# EAGLE board Sij (EAGLE 7.6.0)
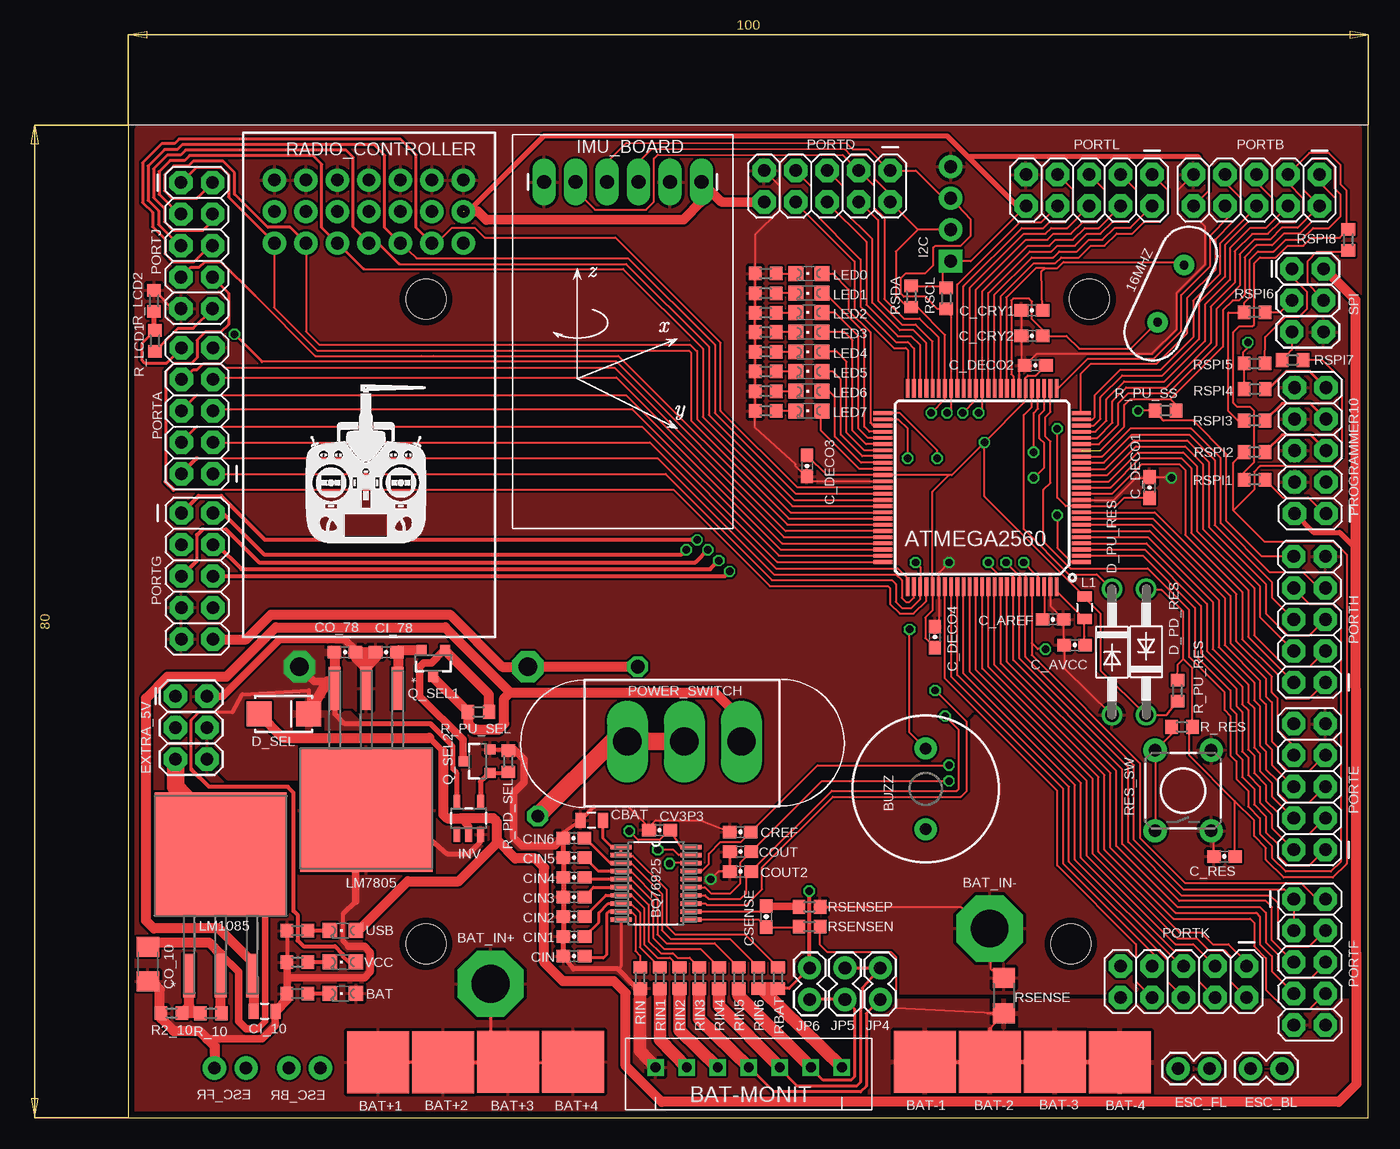
[diagram p2: board, top side]
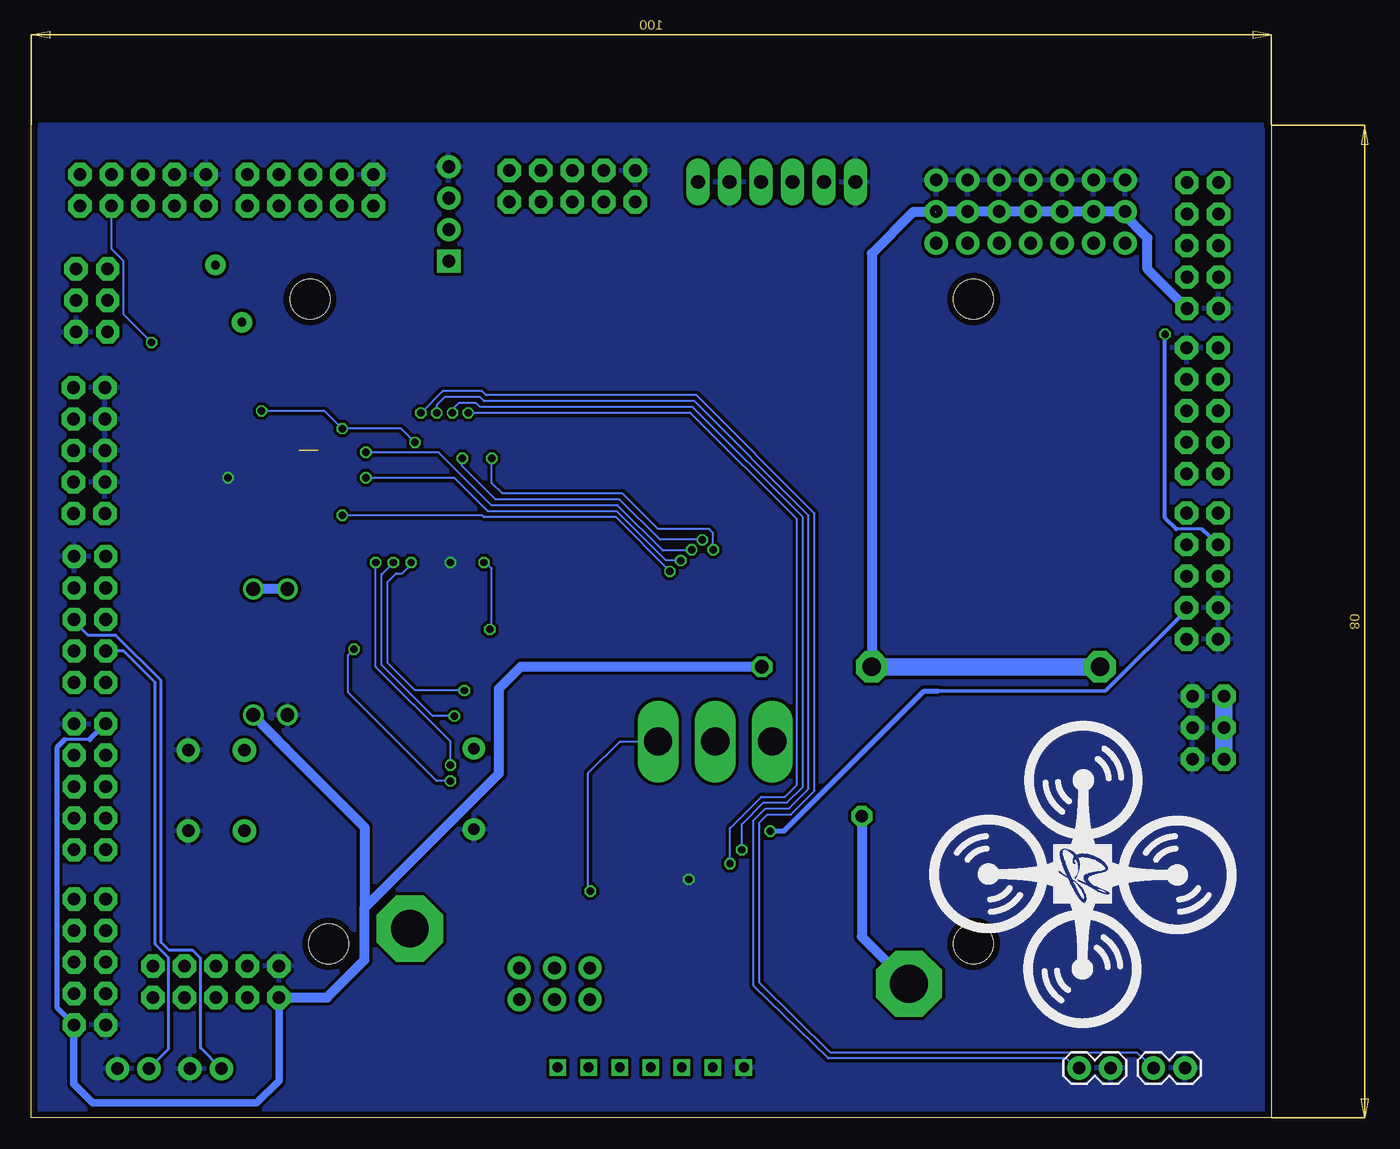
[diagram p3: board, bottom side, seen from below]

Size 100 x 80 mm. Coordinates in mm from the lower left corner, seen from the top.
Outline: 100,80 100,0 0,0 0,80
Copper layers (1*16): Top 0.035mm / dielectric 1.5mm / Bottom 0.035mm
Design rules "ShenZhen2U_2layer_EagleRules": minimum track width 7mil, minimum drill 12mil, track to track 7mil, track to pad 7mil, pad to pad 7mil, via to via 7mil, smd to smd 0mil, copper to edge 20mil, drill to drill 10mil, minimum pad ring 10mil, minimum via ring 6mil, stop-mask expansion 2mil, vias tented up to drill 25mil, thermal gap 10mil
Holes 3.2 mm at 24,14 76,14 77.51,66 24,66

## Footprints (pad centres in the part's own frame; a part is rotated, then mirrored left to right if it is on the bottom)
HC49US = drill 0.7 pad 1.651: 1 -2.54,0; 2 2.54,0
TQFP100 = smd 1.5 x 0.3: 1 -8,6; 2 -8,5.5; 3 -8,5; 4 -8,4.5; 5 -8,4; 6 -8,3.5; 7 -8,3; 8 -8,2.5; 9 -8,2; 10 -8,1.5; 11 -8,1; 12 -8,0.5; 13 -8,0; 14 -8,-0.5; 15 -8,-1; 16 -8,-1.5; 17 -8,-2; 18 -8,-2.5; 19 -8,-3; 20 -8,-3.5; 21 -8,-4; 22 -8,-4.5; 23 -8,-5; 24 -8,-5.5; 25 -8,-6; 51 8,-6; 52 8,-5.5; 53 8,-5; 54 8,-4.5; 55 8,-4; 56 8,-3.5; 57 8,-3; 58 8,-2.5; 59 8,-2; 60 8,-1.5; 61 8,-1; 62 8,-0.5; 63 8,0; 64 8,0.5; 65 8,1; 66 8,1.5; 67 8,2; 68 8,2.5; 69 8,3; 70 8,3.5; 71 8,4; 72 8,4.5; 73 8,5; 74 8,5.5; 75 8,6 | smd 0.3 x 1.5: 26 -6,-8; 27 -5.5,-8; 28 -5,-8; 29 -4.5,-8; 30 -4,-8; 31 -3.5,-8; 32 -3,-8; 33 -2.5,-8; 34 -2,-8; 35 -1.5,-8; 36 -1,-8; 37 -0.5,-8; 38 0,-8; 39 0.5,-8; 40 1,-8; 41 1.5,-8; 42 2,-8; 43 2.5,-8; 44 3,-8; 45 3.5,-8; 46 4,-8; 47 4.5,-8; 48 5,-8; 49 5.5,-8; 50 6,-8; 76 6,8; 77 5.5,8; 78 5,8; 79 4.5,8; 80 4,8; 81 3.5,8; 82 3,8; 83 2.5,8; 84 2,8; 85 1.5,8; 86 1,8; 87 0.5,8; 88 0,8; 89 -0.5,8; 90 -1,8; 91 -1.5,8; 92 -2,8; 93 -2.5,8; 94 -3,8; 95 -3.5,8; 96 -4,8; 97 -4.5,8; 98 -5,8; 99 -5.5,8; 100 -6,8
CHIPLED_0805 = smd 1.2 x 1.2: A 0,-1.05; C 0,1.05
4.5MM_SQUARE = smd 5 x 5: IN 0,0
7_PIN_JST-XH = drill 0.8 square: P$1 2.45,3.4; P$2 4.95,3.4; P$3 7.45,3.4; P$4 9.95,3.4; P$5 12.45,3.4; P$6 14.95,3.4; P$7 17.45,3.4
AWG10_HOLE_PAD = drill 3.048 pad 5.334 octagon: BAT_CONNECTOR 0,0
PW20 = smd 1.676 x 0.356: 1 -2.819,2.925; 2 -2.819,2.275; 3 -2.819,1.625; 4 -2.819,0.975; 5 -2.819,0.325; 6 -2.819,-0.325; 7 -2.819,-0.975; 8 -2.819,-1.625; 9 -2.819,-2.275; 10 -2.819,-2.925; 11 2.819,-2.925; 12 2.819,-2.275; 13 2.819,-1.625; 14 2.819,-0.975; 15 2.819,-0.325; 16 2.819,0.325; 17 2.819,0.975; 18 2.819,1.625; 19 2.819,2.275; 20 2.819,2.925
BUZZER-12MM = drill 0.9 pad 1.778: + 3.25,0; - -3.25,0
0603-CAP = smd 1.1 x 1: 1 -0.85,0; 2 0.85,0
0805 = smd 0.8 x 1.2: 1 -0.9,0; 2 0.9,0
1206 = smd 1.6 x 1.8: 1 -1.4,0; 2 1.4,0
DO41-10 = drill 1.118: A 5.08,0; C -5.08,0
SMA-DIODE_ALT = smd 2 x 2: A -2,0; C 2,0
1X02 = drill 1.016 pad 1.88: 1 0,0; 2 2.54,0
2X3 = drill 1.016 pad 1.88 octagon: 1 0,0; 2 0,2.54; 3 2.54,0; 4 2.54,2.54; 5 5.08,0; 6 5.08,2.54
1X04_NO_SILK = drill 1.016 pad 1.88 square: 1 0,0 | drill 1.016 pad 1.88: 2 2.54,0; 3 5.08,0; 4 7.62,0
1X06_LONGPADS = drill 1.118 pad 1.88 long: 1 0,0; 2 2.54,0; 3 5.08,0; 4 7.62,0; 5 10.16,0; 6 12.7,0
SOT23-5 = smd 0.55 x 1.2: 1 -0.95,-1.3; 2 0,-1.3; 3 0.95,-1.3; 4 0.95,1.3; 5 -0.95,1.3
KTT3 = smd 0.965 x 3.505: 1 -2.54,-9.677; 2 0,-9.677; 3 2.54,-9.677 | smd 10.668 x 9.957: 4 0,0.152
AVR_ICSP = drill 1.016 pad 1.88 octagon: 1 -1.27,5.08; 2 1.27,5.08; 3 -1.27,2.54; 4 1.27,2.54; 5 -1.27,0; 6 1.27,0; 7 -1.27,-2.54; 8 1.27,-2.54; 9 -1.27,-5.08; 10 1.27,-5.08
SWITCH-SPDT_KIT = drill 2.286 pad 3.302 long: 1 0,4.597; 2 0,0; 3 0,-4.597
SOT23-3 = smd 0.8 x 0.9: 1 -0.95,-1; 2 0.95,-1; 3 0,1.1
R0603 = smd 1 x 1.1: 1 -0.85,0; 2 0.85,0
3X07 = drill 1.016 pad 1.88: 1 0,0; 2 2.54,0; 3 5.08,0; 4 7.62,0; 5 10.16,0; 6 12.7,0; 7 15.24,0; 8 0,-2.54; 9 2.54,-2.54; 10 5.08,-2.54; 11 7.62,-2.54; 12 10.16,-2.54; 13 12.7,-2.54; 14 15.24,-2.54; 15 0,-5.08; 16 2.54,-5.08; 17 5.08,-5.08; 18 7.62,-5.08; 19 10.16,-5.08; 20 12.7,-5.08; 21 15.24,-5.08
TACTILE-PTH = drill 1.016 pad 1.88: 1 -3.251,2.261; 2 3.251,2.261; 3 -3.251,-2.261; 4 3.251,-2.261
R1206 = smd 1.6 x 1.803: 1 -1.422,0; 2 1.422,0

## Placement (x,y rotation side)
16MHZ  16MHz  [HC49US]  84.06,66.44 245 top
ATMEGA2560  ATMEGA2560AU  [TQFP100]  68.85,50.8 180 top
BAT  [CHIPLED_0805]  17.3,10 90 top
BAT+1  BULLET_PAD  [4.5MM_SQUARE]  20.14,4.45 0 top
BAT+2  BULLET_PAD  [4.5MM_SQUARE]  25.38,4.45 0 top
BAT+3  BULLET_PAD  [4.5MM_SQUARE]  30.62,4.5 0 top
BAT+4  BULLET_PAD  [4.5MM_SQUARE]  35.85,4.5 0 top
BAT-1  BULLET_PAD  [4.5MM_SQUARE]  64.24,4.5 0 top
BAT-2  BULLET_PAD  [4.5MM_SQUARE]  69.47,4.5 0 top
BAT-3  BULLET_PAD  [4.5MM_SQUARE]  74.71,4.5 0 top
BAT-4  BULLET_PAD  [4.5MM_SQUARE]  79.95,4.45 0 top
BAT-MONIT  7_PIN_JST-XH  [7_PIN_JST-XH]  40.08,0.63 0 top
BAT_IN+  AWG_10_HOLE_PAD  [AWG10_HOLE_PAD]  29.21,10.79 180 top
BAT_IN-  AWG_10_HOLE_PAD  [AWG10_HOLE_PAD]  69.45,15.24 180 top
BQ76925  BQ76925_PW_20  [PW20]  42.55,18.89 0 top
BUZZ  BUZZERPTH  [BUZZER-12MM]  64.29,26.5 270 top
C_AREF  0.1u  [0603-CAP]  74.57,40.16 0 top
C_AVCC  0.1u  [0603-CAP]  76.31,38.1 180 top
C_CRY1  22pF  [0603-CAP]  72.87,65.09 0 top
C_CRY2  22pF  [0603-CAP]  72.87,63.02 0 top
C_DECO1  0.1uF  [0603-CAP]  82.35,50.8 90 top
C_DECO2  0.1uF  [0603-CAP]  73.14,60.64 180 top
C_DECO3  0.1uF  [0603-CAP]  54.72,52.55 270 top
C_DECO4  0.1uF  [0603-CAP]  65.04,38.74 90 top
C_RES  0.1uF  [0603-CAP]  88.39,21.05 180 top
CBAT  10uF  [0805]  37.37,23.97 180 top
CI_10  10uF  [0805]  11,8.58 0 top
CI_78  0.22uF  [0603-CAP]  20.8,37.51 180 top
CIN  1.0uF  [0603-CAP]  35.94,13.02 180 top
CIN1  1.0uF  [0603-CAP]  35.94,14.6 180 top
CIN2  1.0uF  [0603-CAP]  35.94,16.19 180 top
CIN3  1.0uF  [0603-CAP]  35.94,17.78 180 top
CIN4  1.0uF  [0603-CAP]  35.94,19.37 180 top
CIN5  1.0uF  [0603-CAP]  35.94,20.96 180 top
CIN6  1.0uF  [0603-CAP]  35.92,22.53 180 top
CO_10  10uF  [1206]  1.58,12.37 270 top
CO_78  0.1uF  [0603-CAP]  17.47,37.51 0 top
COUT  0.1u  [0603-CAP]  49.37,21.43 180 top
COUT2  1.0uF  [0603-CAP]  49.37,19.84 180 top
CREF  1.0uF  [0603-CAP]  49.35,23.03 180 top
CSENSE  0.1u  [0603-CAP]  51.43,16.19 90 top
CV3P3  4.7uF  [0603-CAP]  42.84,23.18 180 top
D_PD_RES  1N4004  [DO41-10]  79.32,37.53 270 top
D_PU_RES  1N4004  [DO41-10]  82.08,37.55 90 top
D_SEL  CDBA320L  [SMA-DIODE_ALT]  12.55,32.54 0 top
ESC_BL  640455 TE connectivity  [1X02]  90.5,3.94 0 top
ESC_BR  640455 TE connectivity  [1X02]  15.5,4 0 bottom
ESC_FL  640455 TE connectivity  [1X02]  84.66,3.94 0 top
ESC_FR  640455 TE connectivity  [1X02]  9.5,4 0 bottom
EXTRA_5V  FEMALE 2x3  [2X3]  3.81,33.97 270 top
I2C  [1X04_NO_SILK]  66.31,69.05 90 top
IMU_BOARD  M06_IMU  [1X06_LONGPADS]  33.52,75.44 0 top
INV  TC7SU04F  [SOT23-5]  27.45,24.13 0 top
JP4  [1X02]  60.64,9.52 90 top
JP5  [1X02]  57.79,12.06 270 top
JP6  [1X02]  54.93,9.52 90 top
L1  10uH  [0805]  77.11,41.12 270 top
LED0  [CHIPLED_0805]  54.89,68.06 90 top
LED1  [CHIPLED_0805]  54.89,66.47 90 top
LED2  [CHIPLED_0805]  54.89,64.92 90 top
LED3  [CHIPLED_0805]  54.89,63.33 90 top
LED4  [CHIPLED_0805]  54.89,61.74 90 top
LED5  [CHIPLED_0805]  54.89,60.16 90 top
LED6  [CHIPLED_0805]  54.89,58.57 90 top
LED7  [CHIPLED_0805]  54.89,56.98 90 top
LM1085  LM1085_KTT_3  [KTT3]  7.46,21.11 0 top
LM7805  LM7805  [KTT3]  19.19,24.92 180 top
PORTA  [AVR_ICSP]  5.56,57 180 top
PORTB  [AVR_ICSP]  90.96,74.77 270 top
PORTD  [AVR_ICSP]  56.35,75.09 270 top
PORTE  [AVR_ICSP]  95.25,26.67 180 top
PORTF  [AVR_ICSP]  95.25,12.54 0 top
PORTG  [AVR_ICSP]  5.56,43.66 0 top
PORTH  [AVR_ICSP]  95.25,40.16 180 top
PORTJ  [AVR_ICSP]  5.53,70.31 0 top
PORTK  [AVR_ICSP]  85.09,10.95 270 top
PORTL  [AVR_ICSP]  77.47,74.77 270 top
POWER_SWITCH  SWITCH_3_PIN  [SWITCH-SPDT_KIT]  44.84,30.32 270 top
PROGRAMMER10  [AVR_ICSP]  95.31,53.78 180 top
Q_SEL1  MOSFET-PCHANNEL  [SOT23-3]  24.59,36.65 180 top
Q_SEL2  MOSFET-NCHANNELAO3404A  [SOT23-3]  28.17,28.73 90 top
R2_10  adj  [R0603]  3.49,8.42 0 top
R_10  121  [R0603]  6.66,8.41 180 top
R_BAT  [R0603]  13.64,9.99 180 top
R_LCD1  2k  [R0603]  2.15,62.62 270 top
R_LCD2  330  [R0603]  2.08,65.85 270 top
R_PD_SEL  10K  [R0603]  30.64,28.72 270 top
R_PU_RES  4.7k  [R0603]  84.59,34.41 270 top
R_PU_SEL  10K  [R0603]  28.24,32.7 180 top
R_PU_SS  4.7k  [R0603]  83.65,57 180 top
R_RES  363  [R0603]  84.96,31.5 180 top
R_USB  [R0603]  13.64,15.07 180 top
R_VCC  [R0603]  13.64,12.53 180 top
RADIO_CONTROLLER  RF_CONTROL_3X7_CON  [3X07]  11.79,75.59 0 top
RBAT  100  [R0603]  52.39,11.26 90 top
RES_SW  SWITCH-MOMENTARY-2PTH  [TACTILE-PTH]  85.06,26.37 90 top
RIN  100  [R0603]  41.27,11.26 90 top
RIN1  100  [R0603]  42.86,11.26 90 top
RIN2  100  [R0603]  44.45,11.26 90 top
RIN3  100  [R0603]  46.04,11.26 90 top
RIN4  100  [R0603]  47.63,11.26 90 top
RIN5  100  [R0603]  49.21,11.26 90 top
RIN6  100  [R0603]  50.8,11.26 90 top
RLED0  [R0603]  51.4,68.06 180 top
RLED1  [R0603]  51.4,66.47 180 top
RLED2  [R0603]  51.4,64.9 180 top
RLED3  [R0603]  51.4,63.33 180 top
RLED4  [R0603]  51.4,61.74 180 top
RLED5  [R0603]  51.4,60.16 180 top
RLED6  [R0603]  51.4,58.57 180 top
RLED7  [R0603]  51.4,56.98 180 top
RSCL  2K  [R0603]  65.95,66.04 270 top
RSDA  2K  [R0603]  63.14,66.2 270 top
RSENSE  1m  [R1206]  70.6,9.83 90 top
RSENSEN  1K  [R0603]  54.93,15.4 180 top
RSENSEP  1K  [R0603]  54.93,16.99 180 top
RSPI1  500  [R0603]  90.8,51.44 0 top
RSPI2  500  [R0603]  90.8,53.66 0 top
RSPI3  500  [R0603]  90.8,56.2 0 top
RSPI4  500  [R0603]  90.83,58.73 0 top
RSPI5  500  [R0603]  90.81,60.81 0 top
RSPI6  500  [R0603]  90.81,64.93 0 top
RSPI7  500  [R0603]  93.88,61.08 180 top
RSPI8  500  [R0603]  98.37,70.77 270 top
SPI  FEMALE 2x3  [2X3]  93.82,68.42 270 top
USB  [CHIPLED_0805]  17.3,15.08 90 top
VCC  [CHIPLED_0805]  17.3,12.54 90 top

## Tracks (layer width: path | path; a pad name or v marks a point on that pad's centre or on a via)
BAT+  (via drill 1 pad 1.68)
  Top 0.254: BAT_IN+.BAT_CONNECTOR 29.21,4.29 | 29.21,4.29 BAT+4.IN | 29.21,4.29 32.06,3.33 29.99,4.29 30.16,4.45 BAT+3.IN | BAT+2.IN 25.23,4.59 | 25.23,4.59 25.23,4.6 | 25.23,4.59 25.23,4.29 25.07,4.45 BAT+1.IN
  Top 0.305: BAT+2.IN 29.83,4.45 29.99,4.29
  Top 1.422: POWER_SWITCH.2 POWER_SWITCH.3 39.03,30.32 v33.01,24.3
  Bottom 0.813: v33.01,24.3 33,14.58 BAT_IN+.BAT_CONNECTOR
  pour Top: 0,10.32 0,0.16 0.16,0 43.18,0 43.34,0.16 43.34,1.43 40.16,4.6 40.16,9.84 38.42,11.59 34.92,11.59 33.66,12.86 33.66,21.11 33.5,21.27 31.27,21.27 30.64,21.91 29.37,21.91 27.62,20.16 22.23,20.16 16.67,14.61 16.67,14.29 12.38,10 1.27,10 0.95,10.32
BAT-
  Top 0.178: RSENSEP.1 67.15,16.99 BAT_IN-.BAT_CONNECTOR 69.53,12.01 RSENSE.2
  pour Top: 61.44,10 81.12,10 81.44,10.32 81.44,20.48 69.53,32.38 68.26,32.38 67.31,31.43 67.31,26.67 66.99,26.35 56.99,26.35 50.8,20.16 50.8,16.67 50.96,16.51 55.72,16.51 55.88,16.67 55.88,13.65 56.36,13.18 60.96,13.18 61.59,12.54 61.59,10.16
CH1
  Top 0.178: ATMEGA2560.68 53.27,48.3 45.39,56.18 45.39,61.68 45.23,61.83 15.24,61.83 11.75,65.33 11.75,70.47 RADIO_CONTROLLER.15
  Top 0.254: PORTJ.1 5.52,76.65 7.46,76.65 8.09,76.02 8.09,74.21 RADIO_CONTROLLER.15
CH2
  Top 0.178: 45.86,61.84 45.86,61.75 | 45.86,61.75 45.86,56.34 53.4,48.8 ATMEGA2560.67 | RADIO_CONTROLLER.16 14.33,63.38 15.4,62.31 45.31,62.31 45.86,61.75
  Top 0.254: RADIO_CONTROLLER.16 13.05,71.79 11.25,71.79 8.58,74.45 8.58,76.19 7.64,77.12 5.25,77.12 4.84,76.72 3.65,76.72 2.93,76.01 2.93,74.72 3.51,74.14 5.55,74.14 PORTJ.2
CH3
  Top 0.178: 19,68.42 39.91,68.42 46.34,61.99 46.34,56.5 53.54,49.3 ATMEGA2560.66
  Top 0.254: 19,68.42 RADIO_CONTROLLER.17 15.6,71.78 15.6,76.85 14.89,77.56 4.93,77.56 4.53,77.17 3.38,77.17 2.49,76.28 2.49,74.45 4.09,72.85 PORTJ.3
CH4
  Top 0.178: 21.86,68.82 40.15,68.82 46.82,62.15 46.82,56.66 53.67,49.8 ATMEGA2560.65
  Top 0.254: 21.86,68.82 20.16,70.51 RADIO_CONTROLLER.18 18.14,71.78 18.14,77.43 17.56,78.01 4.62,78.01 4.22,77.61 3.16,77.61 2.04,76.5 2.04,74.19 2.93,73.3 2.93,72.23 3.6,71.56 6.04,71.56 6.8,72.32 PORTJ.4
CH5
  Top 0.178: ATMEGA2560.64 53.81,50.3 47.29,56.81 47.29,62.31 40.31,69.3 23.24,69.3 RADIO_CONTROLLER.19
  Top 0.254: PORTJ.5 4.14,70.31 2.44,72.01 2.44,73.12 1.6,73.97 1.6,76.72 2.93,78.05 3.96,78.05 4.36,78.45 19.82,78.45 20.69,77.59 20.69,71.74 21.92,70.51 RADIO_CONTROLLER.19
CH6
  Top 0.178: ATMEGA2560.63 53.94,50.8 47.77,56.97 47.77,62.47 39.28,70.96 28.73,70.96 27.94,71.75 26.11,71.75 24.87,70.51 RADIO_CONTROLLER.20
  Top 0.254: PORTJ.6 6.61,70.31 5.33,69.03 3.6,69.03 2.98,69.65 2.98,70.81 1.96,71.83 1.96,72.99 1.16,73.79 1.16,76.99 2.71,78.54 3.73,78.54 4.09,78.9 21.96,78.9 23.22,77.64 23.22,71.75 24.46,70.51 RADIO_CONTROLLER.20
CV3P3  (via drill 0.6)
  Top 0.178: BQ76925.20 44.58,21.82 CV3P3.1 43.66,23.18 42.85,22.38 41.1,22.38 v40.41,23.1
  Bottom 0.305: PORTG.8 6.83,40.94 13.33,34.44 26.89,34.39
  Bottom 0.406: v40.41,23.1 39.29,23.1 28,34.39 26.89,34.39
GND  (via drill 0.6)
  Top 0.178: C_DECO4.2 65.35,39.91 ATMEGA2560.81 65.35,43.93 v66.18,44.75 | ATMEGA2560.99 74.35,41.23 C_AREF.2 75.42,38.15 C_AVCC.2 75.46,36.23 D_PD_RES.A | ATMEGA2560.32 71.85,60.21 C_DECO2.2 | ATMEGA2560.11 79.48,49.8 81.25,51.58 82.27,51.58 C_DECO1.2 84.04,51.65 v84.11,51.58 | C_RES.2 87.54,22.9 RES_SW.3 | 37.57,25.07 40.31,25.07 42.2,23.18 CV3P3.2 41.99,23.42 42.53,23.96 46.13,23.96 CREF.2 | COUT2.2 COUT.2 48.52,19.88 48.56,19.84 47.61,19.84 v46.98,19.2 | ATMEGA2560.62 54.57,51.3 C_DECO3.2 54.63,51.7 53.8,52.53 53.8,52.69 50.55,55.62 RLED7.2 RLED6.2 RLED5.2 RLED4.2 RLED3.2 RLED2.2 | PORTD.9 52.53,75.1 52.53,73.16 50.55,71.18 RLED0.2 RLED1.2 50.55,66.49 RLED2.2 | RLED2.2 50.59,64.96 | C_CRY1.1 C_CRY2.1 | C_CRY2.1 | C_CRY2.1 72.02,60.76 C_DECO2.2 | C_DECO2.2 72.31,60.64 73.26,61.59 82.55,61.59 84.53,63.58 84.53,66.52 86.84,68.82 86.84,71.83 86.44,72.23 85.25,72.23 84.61,72.87 84.61,74.77 PORTB.9
  Top 0.254: BQ76925.10 39.73,12.2 39.5,11.97 | R_LCD2.1 3.55,65.23 PORTJ.9
  Top 0.305: CIN6.2 35.07,22.99 CBAT.2 37.57,25.07 | LM7805.2 19.19,33.95 19.04,33.8 | R_USB.2 R_VCC.2 | R_BAT.2 12.79,9.78 12.54,9.52 | 17.3,14.28 17.34,14.32 17.34,16.45 | 31.1,29.68 30.75,29.68 R_PD_SEL.1 30.52,29.68 Q_SEL2.2
  Top 0.406: LM7805.4 21.73,24.77 25.71,21.27 27.45,21.27 28.41,22.22 28.41,22.82 INV.3 | 17.3,14.28 17.77,13.81 | RIN.1 41.05,10.63 40.84,10.63 39.5,11.97 35.89,11.97 CIN.2 CIN1.2 CIN2.2 CIN3.2 CIN4.2 CIN5.2 35.07,20.98 CIN6.2 | 17.34,16.45 18.33,17.44
  Top 0.61: 31.1,29.68 31.91,28.87 31.91,27.03 31.07,26.18 31.07,22.58 31.74,21.91 33.63,21.91 33.17,21.9 34.43,21.9 CIN6.2 | CI_10.2 11.85,7.41 10.79,6.35 7.46,6.35 6.35,6.35 | CO_78.2 18.32,37.7 17.46,38.56 12.22,38.56 7.62,33.96 EXTRA_5V.2 | R_VCC.2 12.79,11.27 | 12.79,11.27 R_BAT.2 | LM7805.4 18.33,23.9 | 18.33,23.9 17.3,22.87 | 17.77,13.81 19.04,13.81 19.52,13.33 19.52,11.74 19.04,11.27 12.79,11.27 | 18.33,17.44 18.33,23.9
  Top 0.813: CO_10.2 1.93,10.97 2.54,10.32 2.54,8.52 R2_10.1 2.64,7.99 3.65,6.98 5.71,6.98 6.35,6.35 6.98,5.74 ESC_FR.2 | CO_78.2 CI_78.2 19.95,37.09 19.2,36.34 | 19.2,36.18 19.2,36.34 | LM7805.2 19.2,34.61 19.2,36.18 | 19.2,36.18 18.41,36.98 18.41,37.61 19.2,36.82 19.2,36.34 | R_BAT.2 12.79,9.52 CI_10.2
  Top 1.016: BAT-MONIT.P$1 41.27,5.38 RIN.1
  pour Bottom (isolate 0.254): 0,80 100,80 100,0 0,0
  pour Top (rank 6): -0.16,80.01 99.85,80.01 100.01,80.17 100.01,0.16 100.17,0 0,0 0,79.85
GND-ISO
  Top 0.178: RSENSE.1 69.49,7.14 | 69.25,8.41 RSENSE.1 | RSENSE.1 61.91,8.85 61.91,12.94 61.52,13.34 56.36,13.34 55.78,13.91 RSENSEN.1
  Top 0.305: BAT-1.IN 67.59,4.45 BAT-2.IN | BAT-2.IN BAT-3.IN 78.06,4.5 BAT-4.IN | 69.49,7.14 BAT-2.IN
  pour Top: 59.05,9.37 59.05,1.27 97.47,1.27 99.06,2.86 99.06,9.21 98.9,9.37
INT_IMU
  Top 0.178: ATMEGA2560.45 65.35,62.87 63.79,64.43 62.53,64.43 60.96,66 60.96,72.55 60.16,73.34 60.16,75.09 PORTD.3 58.85,76.36 57.61,77.6 42.71,77.64 42.39,77.33 42.39,73.83 41.76,73.2 37.63,73.2 36.04,74.79 36.04,75.43 IMU_BOARD.2
LCD_V0
  Top 0.254: 2.08,64.97 R_LCD2.2 | R_LCD1.1 1.09,62.41 1.09,61.1 1.34,60.85 3.08,60.85 4.29,62.05 PORTA.10
  Top 0.406: R_LCD1.1 2.08,63.54 R_LCD2.2
MISO  (via drill 0.6)
  Top 0.178: PORTB.4 91.76,71.75 90.49,71.75 88.82,70.09 88.82,67.55 86.81,65.54 86.81,62.61 83.56,59.35 80.3,59.35 78.87,57.92 78.87,56.18 77.99,55.3 ATMEGA2560.22 | RSPI4.1 89.94,58.8 RSPI5.1 89.92,60.81 RSPI5.1 89.92,60.85 89.92,61.74 90.28,62.1 v90.28,62.5
  Bottom 0.178: v90.28,62.5 92.55,64.76 92.55,69.08 93.5,70.03 PORTB.4
MOSI
  Top 0.178: RSPI1.1 89.95,52.03 90.78,52.85 90.78,56.97 90.46,57.29 89.44,57.29 89.11,57.62 89.11,63.32 89.59,63.8 90.62,63.8 90.78,63.96 90.78,68.88 91.25,69.35 92.52,69.35 93.47,70.3 94.74,70.3 95.38,70.94 97.69,70.94 RSPI8.1 98.23,71.76 98.23,74.75 97.76,75.22 97.76,76.81 96.81,77.76 95.23,77.76 PORTB.3 93.47,76.01 93.47,75.38 94.74,74.11 94.74,72.84 94.11,72.21 92.84,72.21 91.89,71.26 90.62,71.26 90.62,71.25 89.22,69.85 89.22,67.32 87.28,65.38 87.28,62.45 83.72,58.88 80.46,58.88 79.35,57.77 79.35,56.02 78.13,54.8 ATMEGA2560.21
N$1
  Top 0.254: PROGRAMMER10.7 95.32,57.59 93.05,57.59 RSPI3.2
N$2
  Top 0.178: RSPI1.2 93.09,50.01 95.13,50.01 96.44,48.7 PROGRAMMER10.1
N$3
  Top 0.254: PROGRAMMER10.9 95.28,60.17 93.34,60.17 91.91,58.73 RSPI4.2
N$4
  Top 0.813: LM7805.1 21.73,35.22 21.74,35.23 21.74,37.51 CI_78.1 21.7,37.65 Q_SEL1.2
N$5
  Top 0.178: C_AVCC.1 77.11,38.79 L1.2 74.85,42.47 ATMEGA2560.100
N$6
  Top 0.178: C_CRY1.2 73.64,68.24 73.9,68.5 | 73.9,68.5 74.93,68.5 75.41,68.98 84.89,68.98 16MHZ.1 | 73.9,68.5 73.18,68.5 70.8,66.12 70.8,58.85 ATMEGA2560.34
N$7
  Top 0.178: BQ76925.6 40.55,18.57 41.96,17.16 41.96,14.22 42.94,13.25 43.92,13.25 44.27,12.89 45.26,12.89 RIN3.2
  Top 0.254: CIN3.1 36.8,17.93 36.88,17.93 37.51,18.57 BQ76925.6
N$8
  Top 0.178: 39.78,21.11 40.68,21.11 43.38,18.4 43.38,15.47 44.09,14.76 49.74,14.76 RBAT.2
  Top 0.254: 39.78,21.11 BQ76925.2 BQ76925.1 38.98,21.82 38.26,22.54 CBAT.1
N$9
  Top 0.178: BQ76925.7 40.58,17.92 41.6,16.89 41.6,13.96 42.67,12.89 43.67,12.89 RIN2.2
  Top 0.254: CIN2.1 38.52,17.92 BQ76925.7
N$10
  Top 0.178: BQ76925.8 39.74,17.25 40.54,17.25 41.25,16.54 41.25,13.73 RIN1.2
  Top 0.254: CIN1.1 37.94,15.75 37.94,16.51 38.7,17.27 BQ76925.8
N$11
  Top 0.178: BQ76925.9 40.54,16.62 40.89,16.27 40.89,13.42 41.27,13.04 RIN.2
  Top 0.254: 40.95,12.44 RIN.2 | BQ76925.9 38.75,16.62 38.58,16.45 38.58,13.13 38.32,12.87 36.8,12.87 CIN.1
N$12
  Top 0.178: BQ76925.5 40.52,19.22 42.32,17.42 42.32,14.49 43.2,13.6 46.14,13.6 RIN4.2
  Top 0.254: BQ76925.5 36.8,19.22 CIN4.1
N$13
  Top 0.305: Q_SEL2.1 30.55,27.78 R_PD_SEL.2
  Top 0.406: Q_SEL2.1 28.4,27.1 INV.4
N$14
  Top 0.178: ATMEGA2560.60 58.95,52.3 55.86,55.39 55.86,56.91 LED7.A
N$15
  Top 0.178: BQ76925.11 50.81,15.97 CSENSE.1 54.02,15.34
  Top 0.61: 54.02,15.34 RSENSEN.2
N$16
  Top 0.178: BQ76925.12 51.01,16.62 CSENSE.2
  Top 0.61: CSENSE.2 54.02,17.04 RSENSEP.2
N$17
  Top 0.178: 39.77,20.47 40.6,20.47 43.03,18.05 43.03,15.11 43.74,14.4 48.51,14.4 RIN6.2
  Top 0.254: 39.77,20.47 BQ76925.3 38.85,20.52 37.31,22.05 CIN6.1
N$18
  Top 0.178: 39.75,19.84 40.53,19.84 42.67,17.69 42.67,14.76 43.38,14.05 47.28,14.05 RIN5.2
  Top 0.254: 39.75,19.84 BQ76925.4 37.9,19.87 37.29,20.48 CIN5.1 37.04,20.95
N$19
  Top 0.178: ATMEGA2560.59 59.08,52.8 56.97,54.91 56.97,58.08 56.49,58.57 LED6.A
N$20
  Top 0.178: ATMEGA2560.58 60.83,53.32 59.2,53.32 57.45,55.07 57.45,59.51 56.8,60.16 LED5.A
N$21
  Top 0.178: ATMEGA2560.57 59.35,53.8 57.92,55.23 57.92,60.94 57.12,61.74 LED4.A
N$22
  Top 0.178: ATMEGA2560.56 59.49,54.3 58.4,55.39 58.4,62.69 57.76,63.33 LED3.A
N$23
  Top 1.016: BAT-MONIT.P$2 42.86,6.29 RIN1.1
N$24
  Top 0.178: SPI.4 95.09,67.28 95.09,69.05 95.85,69.81 98.26,69.81 RSPI8.2
N$25
  Top 0.178: ATMEGA2560.55 59.62,54.8 58.88,55.55 58.88,63 56.96,64.92 LED2.A
N$26
  Top 0.178: ATMEGA2560.54 59.76,55.3 59.35,55.7 59.35,63.28 56.17,66.47 LED1.A
N$27
  Top 1.016: BAT-MONIT.P$3 44.45,7.04 RIN2.1
N$28
  Top 0.254: BAT-MONIT.P$4 50.11,4 52.05,2.06 59.04,2.06 59.51,2.54 59.51,8.39 JP4.1
  Top 1.016: BAT-MONIT.P$4 46.04,7.95 RIN3.1
N$29
  Top 0.254: BAT-MONIT.P$5 52.46,4.04 53.96,2.54 58.72,2.54 59.04,2.86 59.04,8.72 59.2,8.88 59.2,10.46 JP4.2 JP5.1
  Top 1.016: BAT-MONIT.P$5 47.63,9.02 RIN4.1
N$30
  Top 0.254: BAT-MONIT.P$6 54.96,4.08 56.02,3.02 58.29,3.02 58.56,3.29 58.56,8.75 JP5.2 JP6.1
  Top 1.016: BAT-MONIT.P$6 49.21,9.85 RIN5.1
N$31
  Top 0.178: LED0.A 56.8,68.06 58.08,66.77 58.08,65.07 59.83,63.32 59.83,56.02 60.05,55.8 ATMEGA2560.53
N$32
  Top 0.305: 4.6,24.76 7.3,22.06 7.3,20.79 7.46,20.63
  Top 0.508: 10.43,7.14 11.04,7.75 11.04,17.18
  Top 0.61: 10.43,7.14 9.52,7.14 8.89,7.78 8.89,11.74 7.46,13.17 | 11.04,17.18 7.46,20.63
  Top 0.813: CO_10.1 2.25,14.12 6.51,14.12 7.46,13.17 LM1085.2 7.46,10.16 7.46,8.46 R_10.1 | LM1085.4 7.46,20.63
  Top 1.422: 4.6,24.76 4.6,25.87 3.81,26.66 EXTRA_5V.5
  Bottom 1.422: EXTRA_5V.5 EXTRA_5V.3 EXTRA_5V.1
N$33
  Top 0.813: R_10.2 R2_10.2 4.92,8.99 4.92,10.16 LM1085.1
N$34
  Top 0.178: RES_SW.1 RES_SW.2 83.77,30.56 84.11,30.9 R_RES.2
N$35
  Top 0.305: R_USB.1 14.5,15.08 USB.C
N$36
  Top 0.178: 16MHZ.2 80.84,61.99 76.68,61.99 75.64,63.02 C_CRY2.2 73.72,63.52 72.87,64.37 72.87,65.8 72.63,66.04 71.36,66.04 71.2,65.88 71.2,59.93 71.36,59.77 ATMEGA2560.33
N$37
  Top 0.406: Q_SEL2.3 26.98,28.89 | 25.43,37.65 Q_SEL1.1
  Top 0.61: 26.98,28.89 26.98,30.47 23.49,33.96 23.49,36.34 23.8,36.66 24.44,36.66 25.43,37.65
  Top 0.813: R_PU_SEL.1 29.09,34.1 Q_SEL1.1
N$38
  Top 0.305: VCC.C R_VCC.1
N$39
  Top 0.178: LED7.C RLED7.1
N$40
  Top 0.178: RLED6.1 LED6.C
N$41
  Top 0.178: LED5.C RLED5.1
N$42
  Top 0.178: RSPI6.2 92.87,64.93 SPI.3
N$43
  Top 0.178: RLED4.1 LED4.C
N$44
  Top 0.178: LED3.C RLED3.1
N$45
  Top 0.178: RLED2.1 53.81,64.9 LED2.C
N$46
  Top 0.178: LED1.C RLED1.1
N$47
  Top 0.178: RLED0.1 LED0.C
N$48
  Top 0.305: BAT.C R_BAT.1
N$55
  Top 0.178: RSPI5.2 91.66,62.93 93.32,64.59 94.43,64.59 95.06,65.23 95.06,66.55 93.82,67.79 SPI.1
N$61
  Top 0.254: PROGRAMMER10.5 96.58,53.8 95.33,55.05 93.04,55.05 RSPI2.2
N$62
  Top 0.178: ATMEGA2560.98 73.85,39.98 C_AREF.1
N$64
  Top 0.178: SPI.5 93.82,61.92 RSPI7.2
PA0  (via drill 0.6)
  Top 0.178: 6.85,51.9 43.33,51.9 51.9,43.33 61.58,43.33 61.89,43.01 61.89,41.58 62.37,41.1 63.16,41.1 63.85,41.79 ATMEGA2560.78 63.85,44.38 v63.48,44.75 | BUZZ.- 63,31.04 v63,39.36
  Top 0.305: PORTA.1 6.85,51.9
  Bottom 0.178: v63,39.36 62.84,39.52 62.84,44.28 63.32,44.75 v63.48,44.75
PA1
  Top 0.178: 5.54,53.16 42.69,53.16 52.05,43.8 61.89,43.8 62.37,43.33 62.37,41.9 62.69,41.58 63,41.58 63.35,41.93 ATMEGA2560.77
  Top 0.305: PORTA.2 5.54,53.16
PA2
  Top 0.178: 6.85,54.43 42.06,54.43 52.21,44.28 62.05,44.28 62.85,43.48 ATMEGA2560.76
  Top 0.254: PORTA.3 6.85,54.43
PA3
  Top 0.178: 5.53,55.7 41.42,55.7 52.32,44.8 ATMEGA2560.75
  Top 0.254: PORTA.4 5.53,55.7
PA4
  Top 0.178: 6.96,57.13 40.63,57.13 52.46,45.3 ATMEGA2560.74
  Top 0.254: PORTA.5 6.96,57.13
PA5
  Top 0.178: 5.53,58.24 40.15,58.24 52.59,45.8 ATMEGA2560.73
  Top 0.254: PORTA.6 5.53,58.24
PA6
  Top 0.178: 6.96,59.67 39.36,59.67 52.73,46.3 ATMEGA2560.72
  Top 0.254: PORTA.7 6.96,59.67
PA7
  Top 0.178: 7.78,60.47 39.2,60.47 52.86,46.8 ATMEGA2560.71
  Top 0.254: PORTA.8 4.31,59.51 4.44,59.51 5.24,60.31 5.55,60.31 6.03,60.78 7.46,60.78 7.78,60.47
PB4
  Top 0.178: PORTB.5 90.96,75.41 92.23,74.14 92.23,72.87 91.6,72.23 90.33,72.23 88.42,70.33 88.42,67.79 86.33,65.7 86.33,62.77 83.4,59.83 80.14,59.83 78.4,58.08 78.4,56.34 77.86,55.8 ATMEGA2560.23
PB5
  Top 0.178: ATMEGA2560.24 77.72,56.3 77.92,56.5 77.92,58.24 79.98,60.31 83.24,60.31 85.86,62.92 85.86,65.85 88.03,68.02 88.03,70.48 90.96,73.42 PORTB.6
PB6
  Top 0.178: PORTB.7 88.42,75.41 89.69,74.14 89.69,72.87 89.21,72.39 89.06,72.23 | ATMEGA2560.25 76.81,56.84 76.81,59.99 77.6,60.78 82.92,60.78 85.38,63.24 85.38,66.1 87.63,68.35 87.63,70.8 89.06,72.23 | 89.06,72.23
PB7
  Top 0.178: PORTB.8 88.4,72.69 88.71,72.61 87.23,71.12 87.23,68.66 84.91,66.33 84.91,63.4 82.69,61.18 77.37,61.18 74.85,58.66 ATMEGA2560.26
PD3
  Top 0.178: ATMEGA2560.46 64.85,62.58 63.48,63.96 62.37,63.96 60.47,65.86 60.47,72.37 59.01,73.82 PORTD.4
PD4
  Top 0.178: ATMEGA2560.47 64.35,62.45 63.32,63.48 62.21,63.48 59.99,65.7 59.99,70.82 57.62,73.18 57.62,75.09 PORTD.5
PD5
  Top 0.178: PORTD.6 56.35,73.78 59.51,70.62 59.51,65.54 62.05,63 63.12,63 63.85,62.27 ATMEGA2560.48
PD6
  Top 0.178: PORTD.7 53.81,76.32 55.07,75.06 55.07,73.16 59.04,69.19 59.04,65.38 61.89,62.53 62.84,62.53 63.35,62.02 ATMEGA2560.49
PD7
  Top 0.178: PORTD.8 53.81,73.78 58.56,69.03 58.56,65.23 61.73,62.05 62.69,62.05 62.85,61.89 ATMEGA2560.50
PE0
  Top 0.178: PORTE.1 95.24,20.31 93.47,20.31 92.68,21.11 92.68,22.06 91.73,23.01 91.73,24.28 90.78,25.23 90.78,26.5 89.82,27.45 89.82,28.88 89.35,29.36 89.35,32.53 88.87,33.01 88.87,34.44 86.02,37.29 86.02,41.1 81.82,45.3 ATMEGA2560.2
PE1
  Top 0.178: PORTE.2 92.2,23.36 92.2,24.44 91.25,25.39 91.25,26.66 90.3,27.61 90.3,29.04 89.82,29.52 89.82,32.69 89.35,33.17 89.35,34.6 86.49,37.45 86.49,41.26 81.95,45.8 ATMEGA2560.3
PE2
  Top 0.178: PORTE.3 95.24,22.85 93.32,22.85 92.68,23.49 92.68,24.6 91.73,25.55 91.73,26.82 90.78,27.77 90.78,29.2 90.3,29.68 90.3,32.85 89.82,33.33 89.82,34.76 86.97,37.61 86.97,41.42 82.09,46.3 ATMEGA2560.4
PE3
  Top 0.178: PORTE.4 92.2,25.9 92.2,26.98 91.25,27.93 91.25,29.36 90.78,29.84 90.78,33.01 90.3,33.49 90.3,34.91 87.44,37.77 87.44,41.58 82.22,46.8 ATMEGA2560.5
PE4
  Top 0.178: PORTE.5 95.24,25.39 93.47,25.39 92.68,26.19 92.68,27.14 91.73,28.09 91.73,29.52 91.25,29.99 91.25,33.17 90.78,33.64 90.78,35.07 87.92,37.93 87.92,41.74 82.36,47.3 ATMEGA2560.6
PE5
  Top 0.178: PORTE.6 92.2,28.45 92.2,29.68 91.73,30.15 91.73,33.33 91.25,33.8 91.25,35.23 88.4,38.09 88.4,41.9 82.49,47.8 ATMEGA2560.7
PE6
  Top 0.178: PORTE.7 95.24,27.93 93.47,27.93 92.68,28.73 92.68,29.84 92.2,30.31 92.2,33.49 91.73,33.96 91.73,35.39 88.87,38.25 88.87,42.06 82.63,48.3 ATMEGA2560.8
PE7
  Top 0.178: PORTE.8 93.98,29.96 92.68,31.26 92.68,33.8 92.2,34.28 92.2,35.55 89.35,38.41 89.35,42.21 82.76,48.8 ATMEGA2560.9
PF0_2  (via drill 0.6)
  Top 0.178: ATMEGA2560.97 73.35,43.61 73.12,43.85 | 73.12,43.85 72.53,43.85 72.35,43.67 ATMEGA2560.95 | 72.37,42.78 ATMEGA2560.95 | ATMEGA2560.95 72.35,37.15 81.1,28.41 81.1,22.38 85.06,18.41 93.19,18.41 PORTF.1 PORTF.3 | BQ76925.17 46.21,19.87 46.82,20.47 46.82,21.27 47.77,22.22 49.39,22.22 CREF.1 55.58,28.41 v66.18,28.41 | v72.21,44.75 73.12,43.85
  Bottom 0.178: v66.18,28.41 66.18,30.31 72.21,36.34 v72.21,44.75
PF1  (via drill 0.6)
  Top 0.178: ATMEGA2560.96 72.85,38.25 | 72.85,38.25 72.85,37.29 81.57,28.57 81.57,22.54 85.22,18.89 94.58,18.89 95.85,17.62 PORTF.2 | BQ76925.15 46.5,18.57 46.98,18.09 48.56,18.09 49.36,18.89 49.36,20.57 COUT.1 55.93,27.14 v66.18,27.14 | v73.95,37.77 73.33,37.77 72.85,38.25
  Bottom 0.178: v66.18,27.14 67.29,27.14 74.43,34.28 74.43,37.29 v73.95,37.77
PF3  (via drill 0.6)
  Top 0.178: PORTF.4 96.49,15.08 95.22,13.81 93.32,13.81 92.68,14.44 92.68,17.3 92.05,17.93 84.9,17.93 80.62,22.22 80.62,28.25 71.85,37.02 ATMEGA2560.94 71.85,43.68 v70.78,44.75 | BQ76925.14 46.52,17.92 46.82,17.62 49.36,17.62 49.83,18.09 49.83,19.45 COUT2.1 56.72,26.34 66.81,26.34 66.97,26.5 66.97,31.26 v65.86,32.38
  Bottom 0.178: v65.86,32.38 67.61,32.38 71.73,36.5 71.73,43.8 v70.78,44.75
PF4  (via drill 0.6)
  Top 0.178: PORTF.5 93.31,12.54 93.31,13.18 92.2,14.28 92.2,16.98 91.73,17.46 84.75,17.46 80.14,22.06 80.14,28.09 71.35,36.88 ATMEGA2560.93 71.35,43.59 71.1,43.85 70.1,43.85 69.35,44.59 v69.35,44.75 | BQ76925.13 46.53,17.27 46.66,17.14 49.83,17.14 51.1,18.41 51.1,20.16 56.81,25.87 67.13,25.87 67.61,26.34 67.61,31.9 v65.07,34.44
  Bottom 0.178: v65.07,34.44 69.03,34.44 71.26,36.66 71.26,43.17 70.54,43.88 70.07,43.88 69.35,44.59 v69.35,44.75
PF5
  Top 0.178: ATMEGA2560.92 70.85,36.75 79.67,27.93 79.67,21.9 84.59,16.98 91.25,16.98 91.73,16.5 91.73,14.12 92.68,13.17 92.68,11.9 93.32,11.27 95.38,11.27 96.52,12.41 PORTF.6
PF6
  Top 0.178: ATMEGA2560.91 70.35,36.61 79.19,27.77 79.19,21.74 84.43,16.5 90.94,16.5 91.25,16.19 91.25,13.97 92.2,13.01 92.2,11.78 PORTF.7 93.79,10
PF7
  Top 0.178: ATMEGA2560.90 69.85,36.48 78.72,27.61 78.72,21.58 84.27,16.03 90.46,16.03 90.78,15.71 90.78,13.81 91.73,12.86 91.73,10.32 93.32,8.73 95.22,8.73 96.49,10 PORTF.8
PG0  (via drill 0.6)
  Top 0.178: ATMEGA2560.51 62.23,56.8 65.23,53.8 v65.23,53.16
  Top 0.305: PORTG.1 5.66,50.12 7.51,50.12 11.05,46.58 v45.87,46.58
  Bottom 0.178: v65.23,53.16 65.23,52.53 62.53,49.83 52.53,49.83 49.29,46.59 45.88,46.59 v45.87,46.58
PG1  (via drill 0.6)
  Top 0.178: v62.84,53.16 62.84,55.55 62.09,56.3 ATMEGA2560.52
  Top 0.305: PORTG.2 6.84,48.72 7.63,48.72 10.95,45.4 44.61,45.4 v44.99,45.78
  Bottom 0.178: v44.99,45.78 45.01,45.8 45.01,47.15 45.32,47.47 49.45,47.47 52.31,50.32 61.99,50.32 62.84,51.18 v62.84,53.16
PG2  (via drill 0.6)
  Top 0.178: ATMEGA2560.70 53.01,47.29 39.36,60.94 10.79,60.94
  Top 0.254: 10.79,60.94 v8.57,63.16
  Bottom 0.254: 5.58,47.45 7.66,47.45
  Bottom 0.305: PORTG.3 5.58,47.45 | v8.57,63.16 8.57,48.36 7.66,47.45
PG3  (via drill 0.6)
  Top 0.178: v73,51.58 73.85,52.43 73.85,54.38 73.48,54.75 73.48,56.66 73.85,57.03 ATMEGA2560.28
  Top 0.305: PORTG.4 7.14,46.2 9.13,44.21 46.91,44.21 v47.61,44.91
  Bottom 0.178: v73,51.58 65.86,51.58 63.16,48.88 52.77,48.88 48.82,44.93 47.63,44.93 v47.61,44.91
PG4  (via drill 0.6)
  Top 0.178: v73,53.64 73,56.81 73.35,57.16 ATMEGA2560.29
  Top 0.254: 5.55,44.93 5.55,46.98 | 6.03,47.45 7.86,47.45
  Top 0.305: PORTG.5 5.55,44.93 | 5.55,46.98 6.03,47.45 | 7.86,47.45 10.54,44.77 45.72,44.77 v46.74,45.78
  Bottom 0.178: v73,53.64 67.13,53.64 62.84,49.36 52.69,49.36 49.05,45.72 46.8,45.72 v46.74,45.78
PG5  (via drill 0.6)
  Top 0.178: v74.91,48.56 74.91,45.93 76.04,44.8 ATMEGA2560.1
  Top 0.305: PORTG.6 48.11,43.66 v48.48,44.04
  Bottom 0.178: v74.91,48.56 63.64,48.56 63.48,48.4 52.85,48.4 v48.48,44.04
PH0
  Top 0.178: ATMEGA2560.12 79.34,50.3 81.73,52.69 84.75,52.69 85.22,52.21 85.22,46.98 89.82,42.37 89.82,38.56 92.68,35.71 92.68,34.44 93.32,33.8 95.24,33.8 PORTH.1
PH1
  Top 0.178: ATMEGA2560.13 79.21,50.8 81.57,53.16 84.9,53.16 85.7,52.37 85.7,47.13 90.3,42.53 90.3,38.76 PORTH.2
PH2
  Top 0.178: PORTH.3 95.26,36.36 93.3,36.36 90.78,38.88 90.78,42.69 86.17,47.29 86.17,52.53 85.06,53.64 81.41,53.64 79.07,51.3 ATMEGA2560.14
PH3
  Top 0.178: PORTH.4 91.25,40.35 91.25,42.85 86.65,47.45 86.65,52.69 85.22,54.12 81.25,54.12 78.94,51.8 ATMEGA2560.15
  Bottom 0.254: PORTH.4 92.53,37.62 89.98,35.07 89.98,13.97 88.91,12.89 88.91,5.53 ESC_BL.1
PH4
  Top 0.178: PORTH.5 95.24,38.88 93.47,38.88 91.73,40.63 91.73,43.01 87.13,47.61 87.13,52.85 85.38,54.59 81.1,54.59 78.8,52.3 ATMEGA2560.16
  Bottom 0.254: PORTH.5 96.52,40.02 95.38,38.88 93.16,38.88 89.51,35.23 89.51,14.12 88.87,13.49 86.97,13.49 86.33,12.86 86.33,5.61 ESC_FL.1
PH5
  Top 0.178: PORTH.6 92.2,41.94 92.2,43.17 87.6,47.77 87.6,53.01 85.54,55.07 80.94,55.07 78.67,52.8 ATMEGA2560.17
PH6
  Top 0.178: PORTH.7 96,42.7 94.74,43.96 92.05,43.96 88.08,47.93 88.08,53.16 85.7,55.55 80.78,55.55 78.53,53.3 ATMEGA2560.18
PH7
  Top 0.178: PORTH.8 93.98,42.66 95.22,41.42 97.12,41.42 97.76,40.79 97.76,20.63 96.97,19.84 93.32,19.84 92.2,20.95 92.2,21.9 91.25,22.85 91.25,24.12 90.3,25.07 90.3,26.34 89.35,27.3 89.35,28.73 88.87,29.2 88.87,32.38 88.4,32.85 88.4,34.28 85.54,37.14 85.54,40.95 82.21,44.28 75.97,44.28 73.8,46.45 73.8,50.62 74.35,51.18 74.35,54.51 73.95,54.91 73.95,56.5 74.35,56.9 ATMEGA2560.27
PJ6
  Top 0.178: ATMEGA2560.69 53.13,47.8 39.52,61.42 24.61,61.42 23.65,61.42 15.08,61.42 10.21,66.28
  Top 0.254: PORTJ.7 5.05,68.56 5.71,68.56 6.19,69.03 7.46,69.03 10.21,66.28
PJ7
  Top 0.178: ATMEGA2560.79 64.35,41.66 63.32,40.63 62.21,40.63 61.42,41.42 61.42,42.69 61.26,42.85 51.74,42.85 43.96,50.62 3.65,50.62
  Top 0.254: PORTJ.8 8.09,66.47 8.09,63.96 7.46,63.32 6.19,63.32 5.55,62.69 5.55,61.26 5.08,60.78 3.65,60.78 3.02,60.15 3.02,51.26
  Top 0.305: 3.02,51.26 3.65,50.62
PK0
  Top 0.178: ATMEGA2560.89 69.35,36.34 78.24,27.45 78.24,21.42 84.75,14.92 86.49,14.92 87.44,13.97 88.71,13.97 90.17,12.51 PORTK.1
PK1
  Top 0.178: ATMEGA2560.88 68.85,36.21 77.76,27.3 77.76,21.27 84.59,14.44 86.17,14.44 87.13,13.49 88.4,13.49 88.87,13.01 88.87,10.98 PORTK.2
PK2
  Top 0.178: ATMEGA2560.87 68.35,36.07 77.29,27.14 77.29,21.11 84.43,13.97 85.86,13.97 87.6,12.22 PORTK.3
PK3
  Top 0.178: ATMEGA2560.86 67.85,35.94 76.81,26.98 76.81,20.95 84.27,13.49 85.7,13.49 86.33,12.86 86.33,10.98 PORTK.4
PK4
  Top 0.178: ATMEGA2560.85 67.35,35.8 76.33,26.82 76.33,20.79 84.9,12.22 PORTK.5
PK5
  Top 0.178: ATMEGA2560.84 66.85,35.67 75.86,26.66 75.86,20.63 83.79,12.7 83.79,10.98 PORTK.6
PK6
  Top 0.178: ATMEGA2560.83 66.35,35.53 75.38,26.5 75.38,20.47 82.68,13.17 82.68,12.25 PORTK.7
PK7
  Top 0.178: ATMEGA2560.82 65.85,35.4 74.91,26.34 74.91,20.31 81.25,13.97 81.25,10.98 PORTK.8
PL0
  Top 0.178: ATMEGA2560.35 70.35,66.23 73,68.88 74.75,68.88 75.22,69.35 76.65,69.35 77.6,70.3 78.72,70.3 79.69,71.28 80.96,71.28 81.92,72.23 83.19,72.23 83.82,72.87 83.82,74.77 PORTL.1
PL1
  Top 0.178: ATMEGA2560.36 69.85,66.36 72.84,69.35 74.59,69.35 75.06,69.83 76.49,69.83 77.45,70.78 78.56,70.78 79.53,71.75 80.8,71.75 PORTL.2
PL2
  Top 0.178: ATMEGA2560.37 69.35,66.5 72.69,69.83 74.43,69.83 74.91,70.3 76.33,70.3 77.29,71.26 78.4,71.26 79.38,72.23 80.64,72.23 81.28,72.87 81.28,74.77 PORTL.3
PL3  (via drill 0.6)
  Top 0.178: PORTL.4 78.24,71.73 77.13,71.73 76.18,70.78 74.75,70.78 74.27,70.3 72.53,70.3 68.85,66.63 ATMEGA2560.38 68.85,57.09 v68.56,56.81
  Bottom 0.178: ESC_FR.1 10.8,5.24 35.55,5.24 41.26,10.86 41.26,23.8 40.63,24.44 38.72,24.44 36.82,26.34 36.82,48.72 46.34,58.24 63.32,58.24 63.64,58.56 66.81,58.56 v68.56,56.81
PL4  (via drill 0.6)
  Top 0.178: PORTL.5 78.74,74.77 78.74,72.87 78.08,72.21 76.97,72.21 76.02,71.26 74.59,71.26 74.11,70.78 72.37,70.78 68.35,66.77 ATMEGA2560.39 68.35,57.88 v67.29,56.81
  Bottom 0.178: ESC_BR.1 15.71,3.97 16.5,4.76 35.71,4.76 41.74,10.61 41.74,23.96 40.79,24.92 38.88,24.92 37.29,26.5 37.29,48.56 46.5,57.77 63.48,57.77 63.8,58.08 66.65,58.08 67.29,57.45 v67.29,56.81
PL5
  Top 0.178: ATMEGA2560.40 67.85,66.9 72.21,71.26 73.95,71.26 74.43,71.73 75.7,71.73 PORTL.6
PL6
  Top 0.178: ATMEGA2560.41 67.35,67.03 72.05,71.73 73.8,71.73 74.27,72.21 75.54,72.21 76.18,72.84 76.18,74.75 76.2,74.77 PORTL.7
PL7
  Top 0.178: ATMEGA2560.42 66.85,67.17 71.89,72.21 73.64,72.21 PORTL.8
RESET
  Top 0.178: 89.1,48.95 90.78,50.62 90.78,52.05 91.25,52.53 97.12,52.53 97.84,53.24 97.84,59.51 96.27,61.08 RSPI7.1 | 89.1,48.95 89.1,52.8 RSPI2.1 | 89.1,48.95 91.59,46.46 97.16,46.46 98.23,45.39 98.23,20.47 97.12,19.36 93.16,19.36 91.73,20.79 91.73,21.74 90.78,22.69 90.78,23.96 89.24,25.5 | 89.24,25.5 85.54,29.2 85.54,31.29 R_RES.1 85.81,36.23 85.06,36.98 | 85.06,36.98 85.06,40.79 83.32,42.53 82.08,42.53 D_PU_RES.A | D_PD_RES.C 79.32,42.56 78.08,43.8 75.86,43.8 72.21,47.45 72.21,56.66 72.85,57.3 ATMEGA2560.30 | R_PU_RES.1 84.62,36.53 85.06,36.98 | C_RES.1 89.24,25.5
  Bottom 0.813: D_PD_RES.C 79.34,42.63 D_PU_RES.A
SCK
  Top 0.178: RSPI3.1 89.45,56.21 88.71,56.95 88.71,64.91 89.93,64.91 RSPI6.1 | RSPI6.1 89.8,64.93 | ATMEGA2560.20 78.26,54.3 79.83,55.86 79.83,57.61 80.62,58.4 83.87,58.4 87.76,62.29 87.76,65.22 89.61,67.07 89.61,69.61 90.81,70.8 92.08,70.8 93.03,71.75 94.3,71.75 PORTB.2 94.74,74.8 94.74,76.65 95.38,77.29 96.65,77.29 97.28,76.65 97.28,74.91 97.76,74.43 97.76,72.69 96.81,71.73 95.54,71.73 94.58,70.78 93.32,70.78 92.36,69.83 91.09,69.83 90.41,69.14 90.41,66.12 89.95,65.67 RSPI6.1
SCL  (via drill 0.6)
  Top 0.178: IMU_BOARD.3 38.58,75.45 38.58,77.01 40.17,78.59 57.92,78.56 58.4,78.08 59.67,78.08 61.39,76.36 PORTD.1 63.5,76.36 65.72,74.13 I2C.3 67.92,72.39 67.92,71.1 67.13,70.3 65.07,70.3 64.91,70.14 64.91,68.72 64.27,68.08 62.69,68.08 62.29,67.69 62.29,66.42 62.53,66.18 64.27,66.18 65.26,65.19 RSCL.2 66.35,64.67 ATMEGA2560.43 66.35,57.13 v66.02,56.81 | BQ76925.19 44.38,21.17 43.96,21.58 v42.69,21.58
  Bottom 0.178: v42.69,21.58 42.69,23.65 40.95,25.39 39.04,25.39 37.77,26.66 37.77,48.4 46.66,57.29 63.8,57.29 64.11,57.61 65.54,57.61 66.02,57.13 v66.02,56.81
SDA  (via drill 0.6)
  Top 0.178: I2C.2 63.66,71.59 | 63.66,71.59 PORTD.2 61.43,74.41 60.15,75.7 60.15,76.97 59.51,77.6 58.24,77.6 57.77,78.08 42.23,78.12 41.12,77.01 41.12,75.45 IMU_BOARD.4 | 63.66,71.59 61.89,69.83 61.89,66.26 62.84,65.35 RSDA.2 63.61,65.35 65.85,63.11 ATMEGA2560.44 65.85,57.91 v64.75,56.81 | BQ76925.18 43.69,20.52 v43.64,20.47
  Bottom 0.178: v43.64,20.47 43.64,23.33 41.1,25.87 39.2,25.87 38.25,26.82 38.25,48.24 46.82,56.81 v64.75,56.81
SS  (1 unrouted)
  Top 0.178: PORTB.1 96.04,75.41 97.31,74.14 97.31,72.87 96.68,72.23 95.41,72.23 94.46,71.28 93.19,71.28 92.23,70.33 90.96,70.33 90.01,69.37 90.01,66.36 89.53,65.88 89.06,65.88 88.27,65.09 88.27,62.16 84.03,57.92 | 78.4,53.8 80.3,55.7 80.3,57.45 80.78,57.92 84.03,57.92 | 84.03,57.92 84.61,57.37 R_PU_SS.1
V_BATT  (via drill 0.6)
  Top 0.254: JP6.2 53.28,10.41 RBAT.1
  Top 0.305: JP6.2 54.91,12.09 v54.91,18.25
  Top 0.813: 10,10.47 LM1085.3 | Q_SEL1.3 24.59,35.5 R_PU_SEL.2 27.45,32.64 27.45,31.74 27.93,31.26 29.84,31.26 30.31,31.74 30.31,33.8 30.79,34.28 | 30.79,34.28 47.29,34.28 49.36,32.22 49.36,29.85 POWER_SWITCH.1 | 30.79,34.28 25.55,39.52 11.9,39.52 7.93,35.55 3.17,35.55 1.43,33.8 1.43,15.87 2.06,15.23 7.3,15.23 10,12.54 LM1085.3 | LM1085.3 10.1,11.33 CI_10.1
  Top 1.016: BAT-MONIT.P$7 51.16,10.31 RIN6.1 RBAT.1
  Bottom 0.178: v54.91,18.25 55.07,18.41 55.07,27.77 52.52,30.32 POWER_SWITCH.1
V_USB
  Top 0.406: 27.45,23.49 INV.2 | PROGRAMMER10.2 95.55,47.19 97.67,47.19 98.74,46.12 98.95,46.12
  Top 0.51: 24.28,30.63 25.39,29.52
  Top 0.61: 26.82,24.12 27.45,23.49
  Top 0.813: SPI.2 96.47,68.42 98.95,65.94 98.95,46.12 98.95,45.28 | 98.95,45.78 98.95,45.28 | 98.95,45.28 99.03,2.7 97.6,1.27 43.01,1.27 40.11,4.17 40.11,10.05 39.16,11 35.05,11 33.53,12.52 33.53,20.17 32.8,20.89 31.2,20.89 29.85,22.25 | 24.28,30.63 12.44,30.63 D_SEL.A | 25.39,29.52 25.39,24.44 25.71,24.12 26.82,24.12 26.83,24.14 29.43,24.14 29.74,23.82 29.74,22.36 29.85,22.25 | USB.A 18.57,15.08 22.54,19.04 26.64,19.04 29.85,22.25
VCC  (via drill 0.6, 1.1 pad 1.68, 1.5 pad 2.54)  (1 unrouted)
  Top 0.178: C_DECO2.1 73.18,59.83 72.53,59.83 72.35,59.66 ATMEGA2560.31 72.35,57.75 v69.03,54.43 | C_DECO1.1 82.3,49.99 80.3,49.99 79.61,49.3 ATMEGA2560.10 75.6,49.3 74.91,49.99 v74.91,55.55 | R_PU_RES.2 83.73,32.46 D_PU_RES.C 78.4,36.06 78.4,40.63 77.11,41.92 L1.1 69.03,50.09 v69.03,54.43 | C_DECO4.1 64.27,38.65 64.27,40.31 64.85,40.89 ATMEGA2560.80 64.85,50.47 66.18,51.8 | PORTL.10 67.94,69.05 I2C.1 65.68,68.55 65.68,67.05 | RSDA.1 65.68,67.05 | PORTB.10 87.13,74.75 87.13,76.65 86.31,77.47 86.28,77.47 | C_DECO3.1 56.32,51.8 ATMEGA2560.61 66.18,51.8 | v81.41,56.97 81.44,57 R_PU_SS.2 83.46,56.18 85.86,56.18 88.56,53.48 88.56,48.09 91.4,45.24 PORTH.10 | v69.03,54.43 66.4,51.8 66.18,51.8 | 65.68,67.05 65.84,66.89 RSCL.1
  Top 0.254: 5.08,28.09 5.08,32.06 5.71,32.69 8.41,32.69 | R_LCD1.2 4.02,63.64 5.24,63.64 6.8,65.2 PORTJ.10
  Top 0.305: 5.08,28.09 6.51,26.66 12.86,26.66 13.33,26.19 13.33,16.66 13.65,16.35 13.65,14.28 14.12,13.81 16.66,13.81 17.3,13.17 17.3,13.01 17.77,12.54 VCC.A | 8.41,32.69 9.21,34.12 14.56,34.44 D_SEL.C
  Top 0.406: INV.5 26.5,27.78 26.19,28.09 26.19,29.92 24.37,31.74 17.46,31.74 16.66,32.53 16.66,34.59 LM7805.3 | 86.28,77.47 67.71,77.47 | 67.71,77.47 66.04,79.14 33.5,79.14 27.41,73.05 RADIO_CONTROLLER.14 | PORTL.10 71.68,73.5 67.71,77.47
  Top 0.61: PORTD.10 51.24,73.82 | 16.08,35.18 14.97,35.18 v13.81,36.34
  Top 0.813: CO_78.1 16.65,37.56 LM7805.3 16.08,35.18 D_SEL.C | PORTD.10 47.8,73.86 IMU_BOARD.6 46.2,75.42 46.2,73.83 44.77,72.41 28.88,72.37 28.2,73.05 RADIO_CONTROLLER.14 | PORTG.10 6.84,38.56 9.52,38.56 11.52,40.56 25.94,40.56 30.15,36.34 v32.22,36.34 41.05,36.34 v41.07,36.36
  Bottom 0.178: v69.03,54.43 70.14,55.55 v74.91,55.55 76.33,56.97 v81.41,56.97
  Bottom 0.254: 95.26,30.47 97.28,30.47
  Bottom 0.406: PORTE.10 95.26,30.47 | 97.28,30.47 97.92,29.84 97.92,8.89 96.52,7.49 PORTF.10
  Bottom 0.61: PORTF.10 96.55,7.43 96.55,2.71 95.03,1.2 81.79,1.2 80.01,2.98 PORTK.10
  Bottom 0.813: RADIO_CONTROLLER.14 RADIO_CONTROLLER.13 RADIO_CONTROLLER.12 RADIO_CONTROLLER.11 RADIO_CONTROLLER.10 RADIO_CONTROLLER.9 RADIO_CONTROLLER.8 12.05,72.99 9.98,70.93 9.98,68.41 PORTJ.10 | D_PU_RES.C 79.51,29.81 73.1,23.41 73.1,16.91 | v32.22,36.34 32.22,69.66 28.85,73.03 27.07,73.03 | v41.07,36.36 60.5,36.36 62.27,34.58 62.27,27.74 73.1,16.91 | PORTK.10 76.12,9.68 73.1,12.7 73.1,16.91
  Bottom 1.422: v32.22,36.34 v13.81,36.34
  pour Top: 7.62,35.23 7.93,35.23 11.59,38.88 15.24,38.88 16.5,37.61 16.5,33.64 16.82,33.33 16.98,33.33 18.41,31.9 18.41,30.79 18.09,30.47 17.14,30.47 14.12,27.46 8.09,27.46 6.51,29.04 6.35,29.2 6.35,34.44 7.14,35.23